# EAGLE design month-led-r1 (EAGLE 6.5.0)
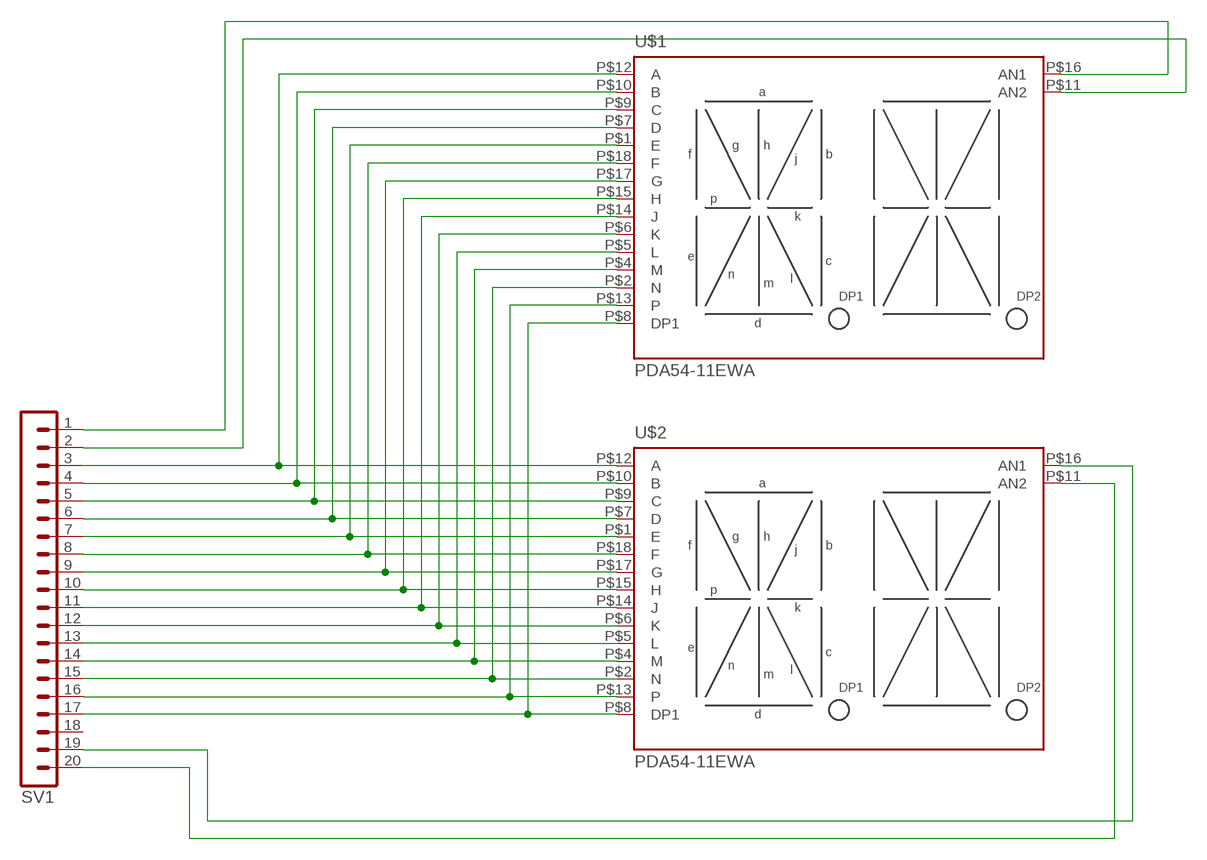
[diagram p0: schematic, sheet 1]

## Parts
SV1  MA20-1W  [MA20-1W]
U$1  PDA54-11EWA  [PDA54-11XX]
U$2  PDA54-11EWA  [PDA54-11XX]

## Nets
N$1: SV1.3 U$1.P$12(A) U$2.P$12(A)
N$2: SV1.4 U$1.P$10(B) U$2.P$10(B)
N$3: SV1.5 U$1.P$9(C) U$2.P$9(C)
N$4: SV1.6 U$1.P$7(D) U$2.P$7(D)
N$5: SV1.7 U$1.P$1(E) U$2.P$1(E)
N$6: SV1.8 U$1.P$18(F) U$2.P$18(F)
N$7: SV1.9 U$1.P$17(G) U$2.P$17(G)
N$8: SV1.10 U$1.P$15(H) U$2.P$15(H)
N$9: SV1.11 U$1.P$14(J) U$2.P$14(J)
N$10: SV1.12 U$1.P$6(K) U$2.P$6(K)
N$11: SV1.13 U$1.P$5(L) U$2.P$5(L)
N$12: SV1.14 U$1.P$4(M) U$2.P$4(M)
N$13: SV1.15 U$1.P$2(N) U$2.P$2(N)
N$14: SV1.16 U$1.P$13(P) U$2.P$13(P)
N$15: SV1.17 U$1.P$8(DP1) U$2.P$8(DP1)
N$17: SV1.2 U$1.P$11(AN2)
N$19: SV1.19 U$2.P$16(AN1)
N$20: SV1.20 U$2.P$11(AN2)
N$22: SV1.1 U$1.P$16(AN1)
Unconnected: SV1.18

## Library data of the parts
SV1 = con-lstb:MA20-1W: PIN HEADER; OC_FARNELL: unknown; OC_NEWARK: unknown
U$1 U$2 = eagle-library-edeca.net-v5:PDA54-11EWA: Kingbright PDA54-11EWA 14 segment common anode LED display

## Board
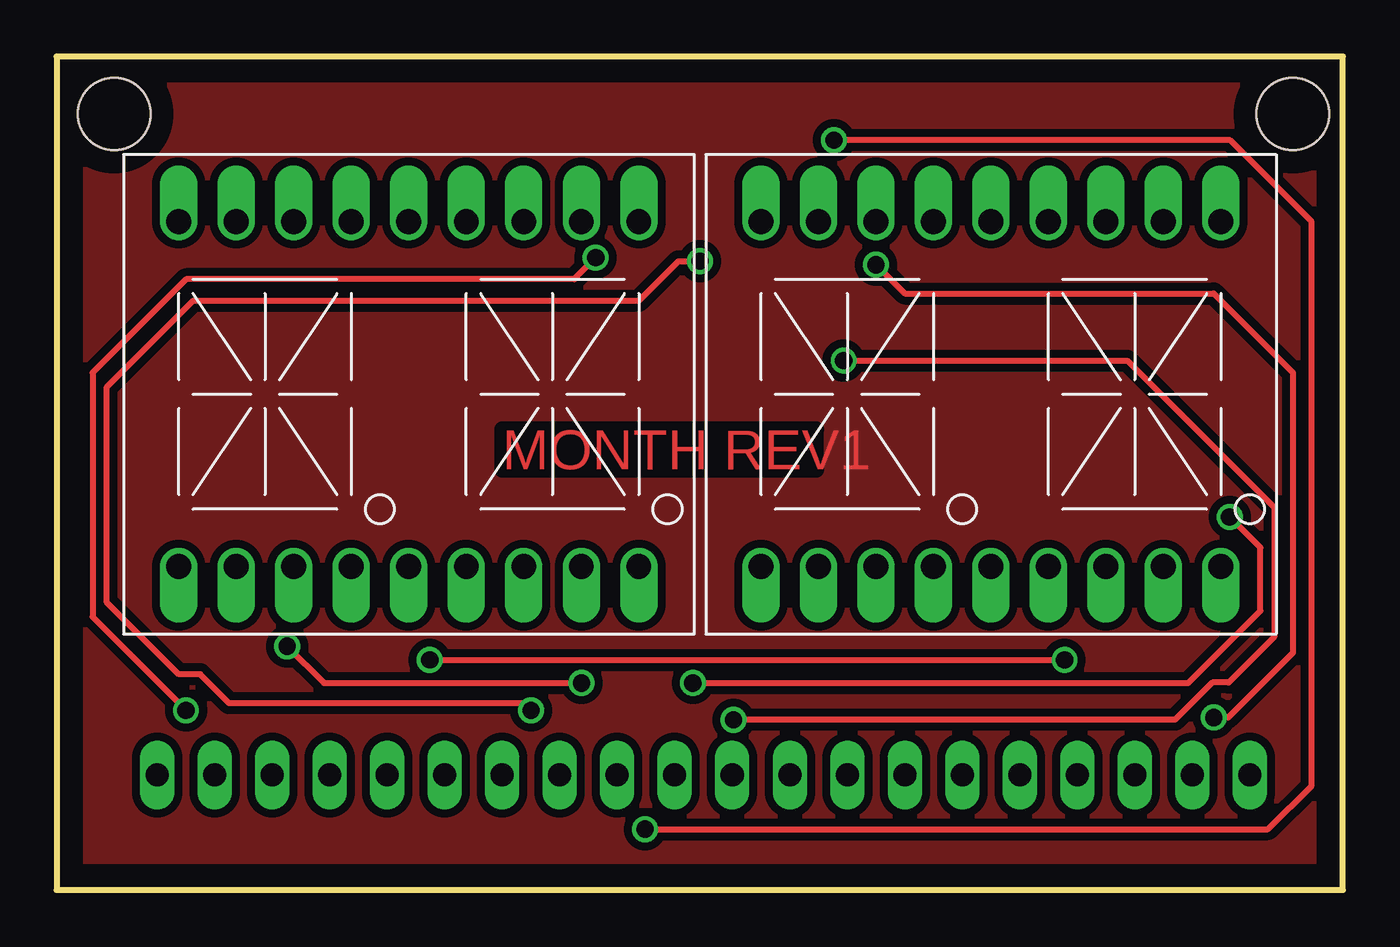
[diagram p1: board, top side]
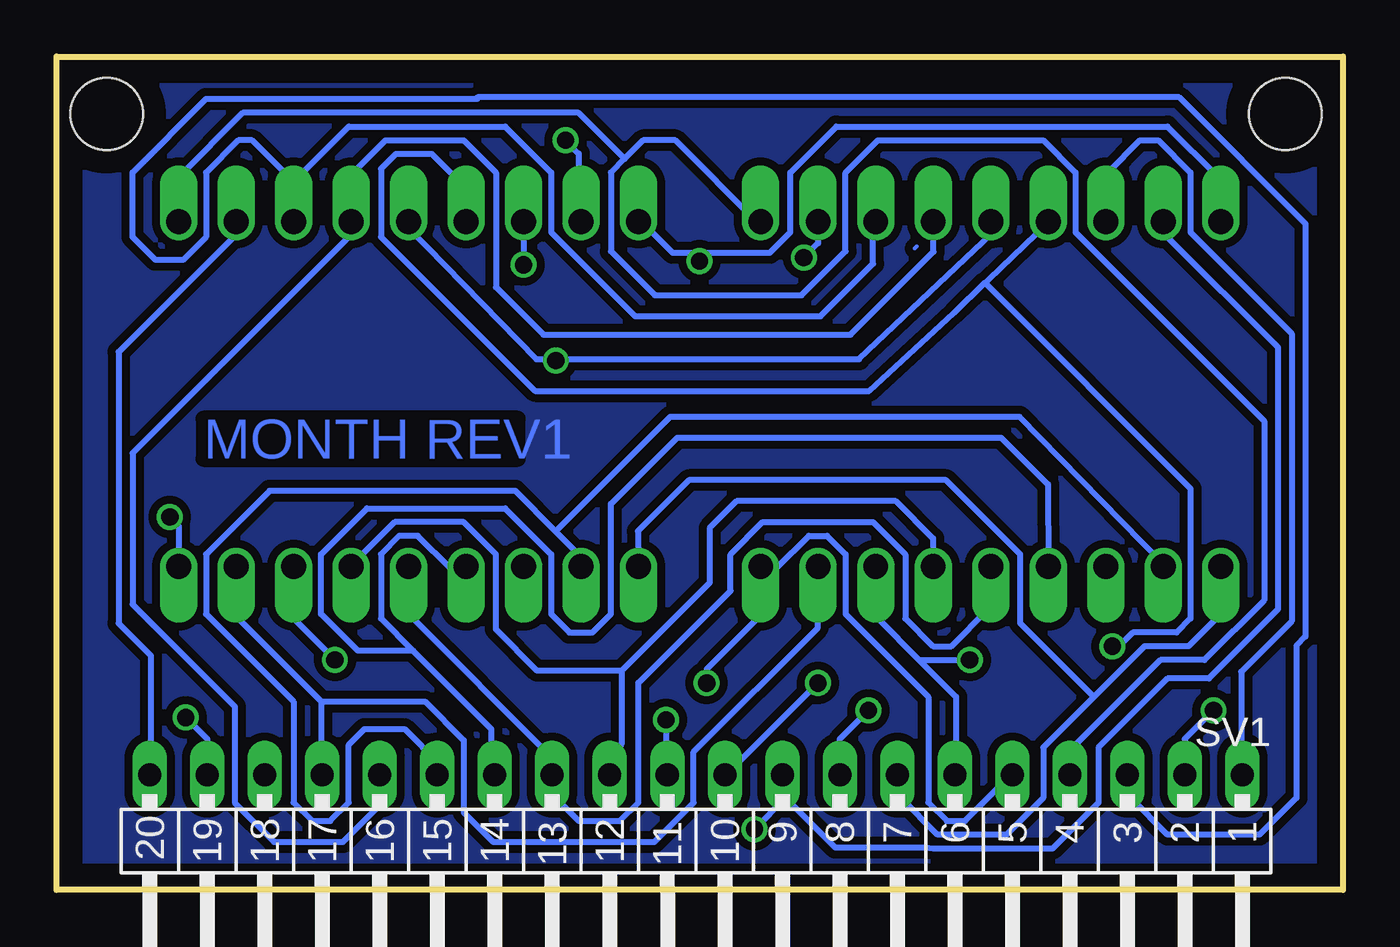
[diagram p2: board, bottom side, seen from below]

Size 56.82 x 36.82 mm. Coordinates in mm from the lower left corner, seen from the top.
Outline: 0,0 56.82,0 56.82,36.82 0,36.82 0,0
Copper layers (1*16): Top 0.035mm / dielectric 1.5mm / Bottom 0.035mm
Design rules "default *": minimum track width 10mil, minimum drill 30mil, track to track 14mil, track to pad 14mil, pad to pad 14mil, via to via 14mil, smd to smd 14mil, copper to edge 40mil, drill to drill 8mil, minimum pad ring 10mil, minimum via ring 7mil, stop-mask expansion 4mil, vias tented up to drill 0mil, thermal gap 10mil
Holes 3.2 mm at 2.54,34.29 54.61,34.29

### Footprints (pad centres in the part's own frame; a part is rotated, then mirrored left to right if it is on the bottom)
MA20-1W = drill 1.016 long: 1 -24.13,0; 2 -21.59,0; 3 -19.05,0; 4 -16.51,0; 5 -13.97,0; 6 -11.43,0; 7 -8.89,0; 8 -6.35,0; 9 -3.81,0; 10 -1.27,0; 11 1.27,0; 12 3.81,0; 13 6.35,0; 14 8.89,0; 15 11.43,0; 16 13.97,0; 17 16.51,0; 18 19.05,0; 19 21.59,0; 20 24.13,0
PDA54-11XX = drill 1.1 offset: P$1 -10.16,-7.62; P$2 -7.62,-7.62; P$3 -5.08,-7.62; P$4 -2.54,-7.62; P$5 0,-7.62; P$6 2.54,-7.62; P$7 5.08,-7.62; P$8 7.62,-7.62; P$9 10.16,-7.62; P$10 10.16,7.62; P$11 7.62,7.62; P$12 5.08,7.62; P$13 2.54,7.62; P$14 0,7.62; P$15 -2.54,7.62; P$16 -5.08,7.62; P$17 -7.62,7.62; P$18 -10.16,7.62

### Placement (x,y rotation side)
SV1  28.58,5.08 180 bottom
U$1  15.56,21.91 0 top
U$2  41.27,21.91 0 top

### Tracks (layer width: path | path; a pad name or v marks a point on that pad's centre or on a via)
N$1
  Bottom 0.254: 46.35,31.29 48.18,33.12 48.79,33.12 50.22,31.7 50.22,28.85 51.23,27.84 52.45,27.84 53.47,28.85 53.47,31.7 50.22,34.95 38.23,34.95 38.23,35.02 7.23,35.02 1.65,29.44 1.65,11.2 2.06,10.79 2.06,4.06 3.68,2.44 7.75,2.44 9.37,4.06 9.37,5.08 SV1.3 | 46.35,31.29 43.92,33.73 37.01,33.73 34.98,31.7 34.98,29.06 31.27,25.35 23.08,25.35 20.75,27.67 20.75,29.46 U$1.P$12 | 46.35,31.29 U$2.P$12
N$2
  Bottom 0.254: 31.73,32.31 30.91,33.12 29.49,33.12 25.83,29.46 U$1.P$10 | 31.73,32.31 32.33,31.7 32.33,28.22 30.39,26.28 23.91,26.28 21.97,28.22 21.97,31.7 20.55,33.12 13.23,33.12 11.81,31.7 11.81,29.06 3.48,20.73 3.48,12.8 6.12,10.16 8.06,10.16 12.01,6.21 12.01,5.08 SV1.4 | U$2.P$10 51.43,31.5 48.59,34.34 33.76,34.34 31.73,32.31
N$3  (via drill 0.76)
  Top 0.254: v51.82,16.48 53.17,15.13 53.17,12.33 49.99,9.14 v28.11,9.14
  Bottom 0.254: 25.54,12.32 25.63,14.22 U$1.P$9 25.54,12.32 | 25.54,12.32 25.02,14.22 23.6,15.65 22.78,15.65 21.97,14.83 21.97,12.19 18.31,8.53 18.31,3.86 17.5,3.05 16.69,3.05 14.66,5.08 SV1.5 | U$2.P$9 51.43,16.1 v51.82,16.48 | v28.11,9.14 28.11,9.75 25.54,12.32
N$4  (via drill 0.76)
  Top 0.254: v16.48,10.16 v44.53,10.16
  Bottom 0.254: 18.72,10.16 20.55,11.99 20.55,14.22 U$1.P$7 | 18.72,10.16 17.09,8.53 17.09,5.08 SV1.6 | U$2.P$7 46.35,11.99 v44.53,10.16 | 18.72,10.16 v16.48,10.16
N$5
  Bottom 0.254: 11,8.53 8.76,10.77 6.82,10.77 5.51,12.08 5.51,14.22 U$1.P$1 | 11,8.53 13.23,6.3 13.23,4.06 14.86,2.44 17.91,2.44 19.53,4.06 19.53,5.08 SV1.7 | 11,8.53 14.25,11.79 14.25,14.83 17.53,18.11 28.89,18.11 31.15,15.86 31.12,14.43 U$2.P$1
N$6  (via drill 0.76 pad 1.02)
  Top 0.254: v20.96,7.94 20.64,8.26 7.62,8.26 6.35,9.53 5.4,9.53 2.22,12.7 2.22,22.23 6.03,26.04 25.72,26.04 27.46,27.78 v28.42,27.78
  Bottom 0.254: 28.42,28.16 29.6,28.16 31.12,29.67 U$2.P$18 | 28.42,28.16 25.31,28.16 24.41,29.06 24.41,31.7 22.38,33.73 7.75,33.73 5.51,31.5 5.51,29.67 U$1.P$18 | SV1.8 22.23,6.67 v20.96,7.94 | v28.42,27.78 28.42,28.16
N$7  (via drill 0.76)
  Top 0.254: v34.34,33.12 51.84,33.12 55.43,29.53 55.43,4.61 53.51,2.69 v25.99,2.69
  Bottom 0.254: 24.61,4.06 24.61,5.08 SV1.9 24.61,4.06 | 24.61,4.06 22.42,1.87 18.47,1.87 18.11,1.83 12.83,1.83 10.79,3.86 10.79,6.3 7.75,9.35 5.92,9.35 2.87,12.39 2.87,23.98 7.75,28.85 7.75,29.46 U$1.P$17 | v34.34,33.12 33.76,32.54 33.76,29.67 U$2.P$17 | 24.61,4.06 v25.99,2.69
N$8  (via drill 0.76)
  Top 0.254: v23.19,9.14 11.81,9.14 v10.19,10.77
  Bottom 0.254: 17.18,25.49 20.92,22.05 35.69,22.05 42.49,28.85 42.49,31.86 41.84,32.51 40.23,32.51 38.68,30.96 38.84,29.67 U$2.P$15 | 17.18,25.49 13.03,29.46 U$1.P$15 | v23.19,9.14 27.25,5.08 SV1.10 | v10.19,10.77 9.89,10.77 9.28,11.38 7.34,11.38 6.73,11.99 6.73,17.74 15.82,26.83 17.18,25.49
N$9  (via drill 0.76)
  Top 0.254: v29.9,7.52 49.4,7.52 51.05,9.17 51.78,9.17 53.78,11.18 53.78,16.89 47.29,23.39 v34.77,23.39
  Bottom 0.254: 34.45,23.45 35.62,23.45 41.27,29.26 U$2.P$14 | 34.45,23.45 21.37,23.45 15.51,28.99 U$1.P$14 | v29.9,7.52 29.9,5.08 SV1.11 | 34.45,23.45 v34.77,23.39 | 34.92,23.32 34.45,23.45
N$10
  Bottom 0.254: 31.86,9.69 31.86,6.51 SV1.12 | 31.86,9.69 27.98,13.57 27.98,15.99 26.78,17.18 19.76,17.18 18.11,15.54 U$1.P$6 | 31.86,9.69 35.59,9.69 37.41,11.51 37.41,14.83 38.84,16.26 41.88,16.26 43.71,14.43 U$2.P$6
N$11
  Bottom 0.254: U$2.P$5 41.27,12.19 34.98,5.89 34.98,5.08 SV1.13 34.77,5.08 34.77,4.06 33.76,3.05 31.93,3.05 31.12,3.86 31.12,9.16 27.05,13.22 27.05,14.83 25.63,16.26 20.75,16.26 19.33,14.83 19.33,11.99 18.11,10.77 17.3,10.77 15.67,12.39 15.67,14.22 U$1.P$5
N$12
  Bottom 0.254: 41.07,10.57 42.49,11.99 42.49,14.83 41.68,15.65 40.87,15.65 39.45,14.22 38.84,14.22 U$2.P$4 | 41.07,10.57 37.62,7.11 37.62,5.08 SV1.14 | 41.07,10.57 43.51,10.57 45.14,12.19 45.14,14.83 43.1,16.87 37.01,16.87 34.98,14.83 34.98,12.19 34.16,11.38 33.15,11.38 32.33,12.19 32.33,17.06 29.4,19.99 15.1,19.99 13.03,17.92 U$1.P$4
N$13
  Bottom 0.254: 34.77,15.85 33.76,14.83 33.76,14.43 U$2.P$2 | 34.77,15.85 36.56,17.63 47.41,17.63 50.22,14.83 50.22,12.19 46.35,8.33 46.35,3.86 45.54,3.05 44.73,3.05 43.92,3.86 43.92,6.41 43.22,7.11 41.45,7.11 39.9,5.56 SV1.15 | 34.77,15.85 29.71,20.92 14.28,20.92 7.95,14.43 U$1.P$2
N$14
  Bottom 0.254: SV1.16 42.7,5.08 42.7,3.59 44.16,2.12 47.21,2.12 48.95,3.86 48.95,8.11 53.47,12.62 53.47,19.3 43.92,28.85 43.92,29.46 U$2.P$13 43.71,29.67 43.71,31.7 42.29,33.12 38.84,33.12 37.41,31.7 37.41,26.63 35.32,24.54 21.74,24.54 18.09,28.19 18.11,29.46 U$1.P$13
N$15
  Bottom 0.254: 45.14,8.33 45.14,5.08 SV1.17 | 45.14,8.33 48.79,11.99 48.79,14.22 U$2.P$8 | 45.14,8.33 40.55,8.33 38.84,6.62 38.84,3.43 37.53,2.12 30.42,2.12 28.68,3.86 28.68,6.1 23.19,11.58 23.19,14.22 U$1.P$8
N$16
  pour Bottom: 0.32,36.83 56.83,36.83 56.83,0.32 0.32,0.32
N$17  (via drill 0.76 pad 1.02)
  Top 0.254: v23.81,27.94 22.86,26.99 5.71,26.99 1.59,22.86 1.59,12.06 v5.71,7.94
  Bottom 0.254: U$1.P$11 23.18,28.57 v23.81,27.94 | v5.71,7.94 6.98,6.67 SV1.2
N$18
  Bottom 0.178: 18.92,28.35 18.83,28.44
N$19  (via drill 0.76 pad 1.02, 0.76 pad 1.14)
  Top 0.254: v36.2,27.62 37.46,26.35 51.12,26.35 54.61,22.86 54.61,10.48 51.75,7.62 v51.12,7.62
  Bottom 0.254: U$2.P$16 v36.2,27.62 | v51.12,7.62 50.16,6.67 SV1.19
N$20
  Bottom 0.254: SV1.20 52.65,5.08 52.65,10.36 54.08,11.79 54.08,23.77 49,28.85 49,29.46 U$2.P$11
N$21
  pour Top: 0,36.83 56.83,36.83 56.83,0.32 0,0.32
N$22
  Bottom 0.254: SV1.1 4.5,5.08 4.5,9.64 2.26,11.87 2.26,24.59 6.73,29.06 6.73,31.7 8.15,33.12 8.97,33.12 10.39,31.7 10.39,29.67 U$1.P$16

### Text on the board
Top: MONTH REV1
Bottom: MONTH REV1